# Altium project MCB_100A.PrjPcb
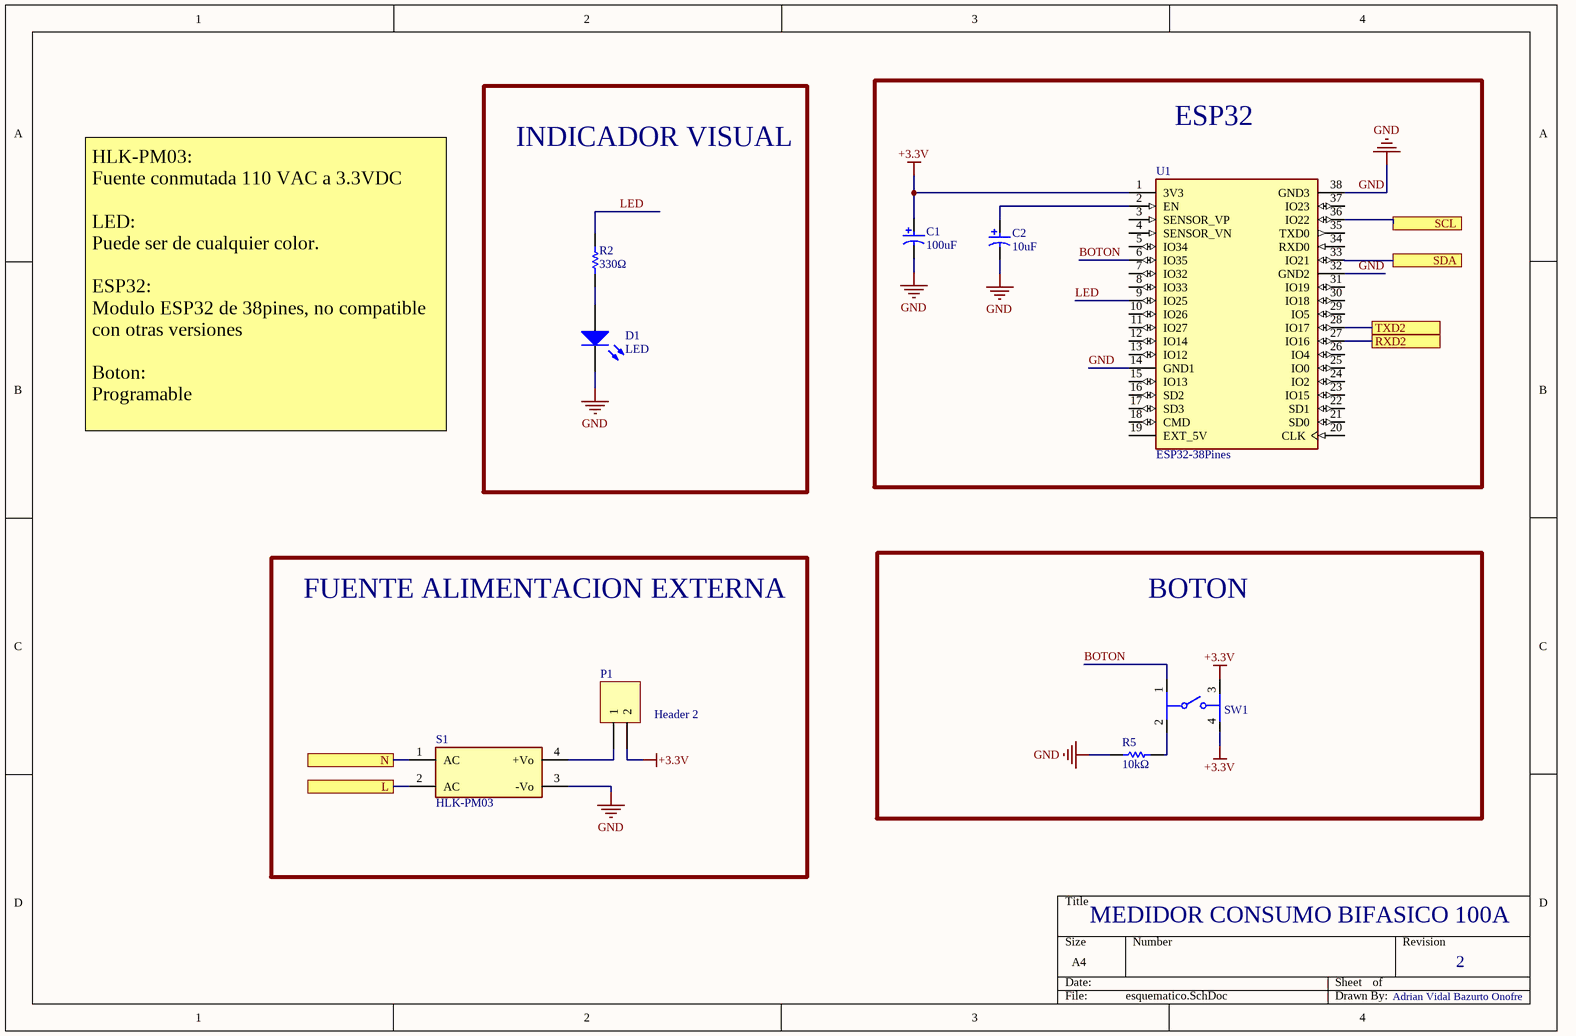
[diagram p0: esquematico.SchDoc]
2 sheets, 13 parts. Net scope: flat (ports and power ports of the same name join across sheets).
Board file: PCB1.PcbDoc
Sheets:
  esquematico.SchDoc
  sensores.SchDoc

## Sheet esquematico.SchDoc
size A4; SheetNumber: 1; SheetTotal: 2

### Parts
C1  100uF  [FP-CAPACITOR]
C2  10uF  [FP-CAPACITOR]
D1  LED  [FP-LED]
P1  Header 2  [HDR1X2]
R2  330Ω  [FP-RESISTENCIA]
R5  10kΩ  [FP-RESISTENCIA]
S1  HLK-PM03  [FP-HLK-PW12]
SW1  Button  [FP-BUTTON]  (value not drawn)
U1  ESP32-38Pines  [ESP32-38pin]

### Blocks framed on the sheet
INDICADOR VISUAL: D1 R2
ESP32: C1 C2 U1
FUENTE ALIMENTACION EXTERNA: P1 S1
BOTON: R5 SW1

### Ports
L, N, RXD2, SCL, SDA, TXD2

### Nets
+3.3V: C1.1 P1.2 SW1.3 SW1.4 U1.1(3V3)
GND: C1.2 C2.2 D1.2(K) R5.1 S1.3(-Vo) U1.14(GND1) U1.32(GND2) U1.38(GND3)
BOTON: SW1.1 U1.6(IO35)
L1: S1.2(AC) ; port L
LED: R2.2 U1.9(IO25)
N: S1.1(AC) ; port N
NetC2_1: C2.1 U1.2(EN)
NetCT1_2: U1.28(IO17) ; port TXD2
NetCT1_3: U1.27(IO16) ; port RXD2
NetCT2_11: U1.36(IO22) ; port SCL
NetCT2_12: U1.33(IO21) ; port SDA
NetD1_1: D1.1(A) R2.1
NetP1_1: P1.1 S1.4(+Vo)
NetR5_2: R5.2 SW1.2

Not connected (* = marked no-connect by the designer): U1 3(SENSOR_VP) 4(SENSOR_VN) 5(IO34) 7(IO32) 8(IO33) 10(IO26) 11(IO27) 12(IO14) 13(IO12) 15(IO13) 16(SD2) 17(SD3) 18(CMD) 19(EXT_5V) 20(CLK) 21(SD0) 22(SD1) 23(IO15) 24(IO2) 25(IO0) 26(IO4) 29(IO5) 30(IO18) 31(IO19) 34(RXD0) 35(TXD0) 37(IO23)

### Notes on the sheet
- HLK-PM03:
  Fuente conmutada 110 VAC a 3.3VDC
  LED:
  Puede ser de cualquier color.
  ESP32:
  Modulo ESP32 de 38pines, no compatible con otras versiones
  Boton:
  Programable
- MEDIDOR CONSUMO BIFASICO 100A
- 2
- Adrian Vidal Bazurto Onofre

### Library data of the parts
C1 C2 = Electrolytic capacitor
P1 = Header 2: Header, 2-Pin; LatestRevisionDate: 17-Jul-2002; LatestRevisionNote: Re-released for DXP Platform.; Publisher: Altium Limited
R2 R5 = Resistencia
S1 = HLK-PM03: 100-240V a 3.3V
SW1 = Button: Button PCB

## Sheet sensores.SchDoc
size A4; SheetNumber: 2; SheetTotal: 2
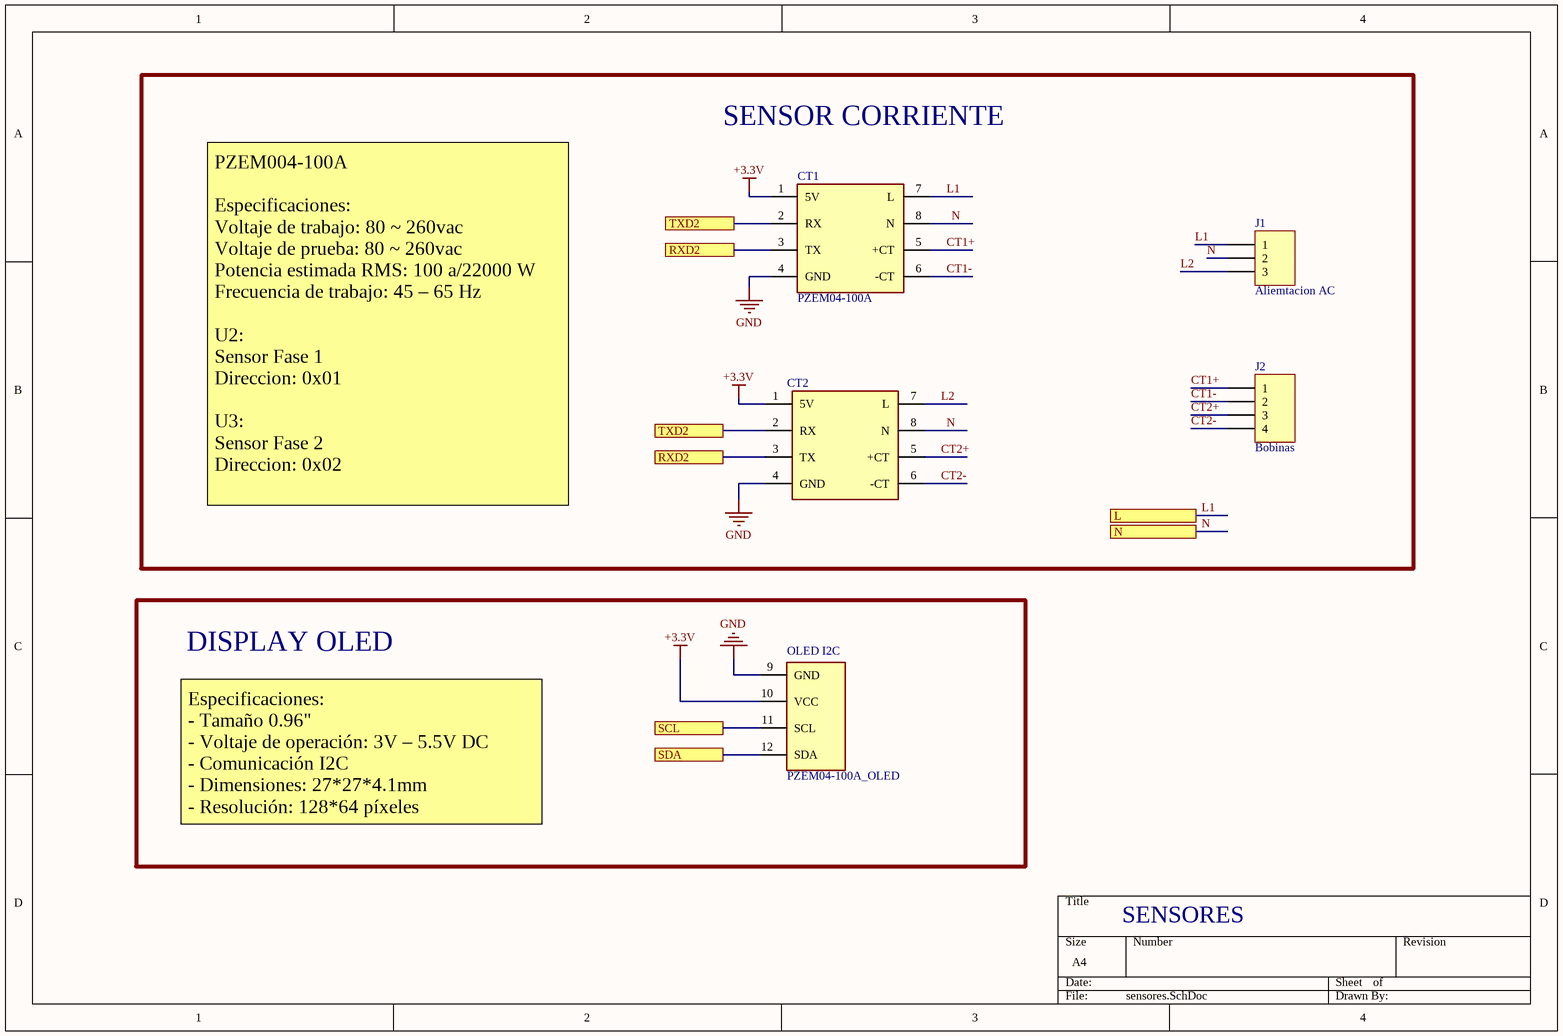
[diagram p1: sensores.SchDoc]

### Parts
CT1  PZEM04-100A  [FP-PZEM-004-100A]
CT2  PZEM04-100A_OLED  [PZEM100A-OLED]
J1  Aliemtacion AC  [Bornera 3]
J2  Bobinas  [BORNERA 4]

### Blocks framed on the sheet
SENSOR CORRIENTE: CT1 CT2 J1 J2

### Ports
L, N, RXD2, SCL, SDA, TXD2

### Nets
+3.3V: CT1.1(5V) CT2.1(5V) CT2.10(VCC)
GND: CT1.4(GND) CT2.4(GND) CT2.9(GND)
CT1+: CT1.5(+CT) J2.1
CT1-: CT1.6(-CT) J2.2
CT2+: CT2.5(+CT) J2.3
CT2-: CT2.6(-CT) J2.4
L1: CT1.7(L) J1.1 ; port L
L2: CT2.7(L) J1.3
N: CT1.8(N) CT2.8(N) J1.2 ; port N
NetCT1_2: CT1.2(RX) CT2.2(RX) ; port TXD2
NetCT1_3: CT1.3(TX) CT2.3(TX) ; port RXD2
NetCT2_11: CT2.11(SCL) ; port SCL
NetCT2_12: CT2.12(SDA) ; port SDA

### Notes on the sheet
- PZEM004-100A
  Especificaciones:
  Voltaje de trabajo: 80 ~ 260vac
  Voltaje de prueba: 80 ~ 260vac
  Potencia estimada RMS: 100 a/22000 W
  Frecuencia de trabajo: 45 – 65 Hz
  U2:
  Sensor Fase 1
  Direccion: 0x01
  U3:
  Sensor Fase 2
  Direccion: 0x02
- DISPLAY OLED
- Especificaciones:
  - Tamaño 0.96"
  - Voltaje de operación: 3V – 5.5V DC
  - Comunicación I2C
  - Dimensiones: 27*27*4.1mm
  - Resolución: 128*64 píxeles
- SENSORES
- (in symbol PZEM04-100A_OLED) OLED I2C

### Library data of the parts
CT1 = PZEM04-100A: Sensor Pzem004 Version 100A
CT2 = PZEM04-100A_OLED: Sensor Pzem004 Version 100A / OLED I2C 0.96
J1 = Conector 3
J2 = Conector 4

## Nets that join several sheets
+3.3V: esquematico (5 pins), sensores (CT1.1 CT2.1 CT2.10)
GND: esquematico (8 pins), sensores (CT1.4 CT2.4 CT2.9)
L1: esquematico (S1.2), sensores (CT1.7 J1.1)
N: esquematico (S1.1), sensores (CT1.8 CT2.8 J1.2)
NetCT1_2: esquematico (U1.28), sensores (CT1.2 CT2.2)
NetCT1_3: esquematico (U1.27), sensores (CT1.3 CT2.3)
NetCT2_11: esquematico (U1.36), sensores (CT2.11)
NetCT2_12: esquematico (U1.33), sensores (CT2.12)